# EAGLE design picotouch (EAGLE 9.6.2)
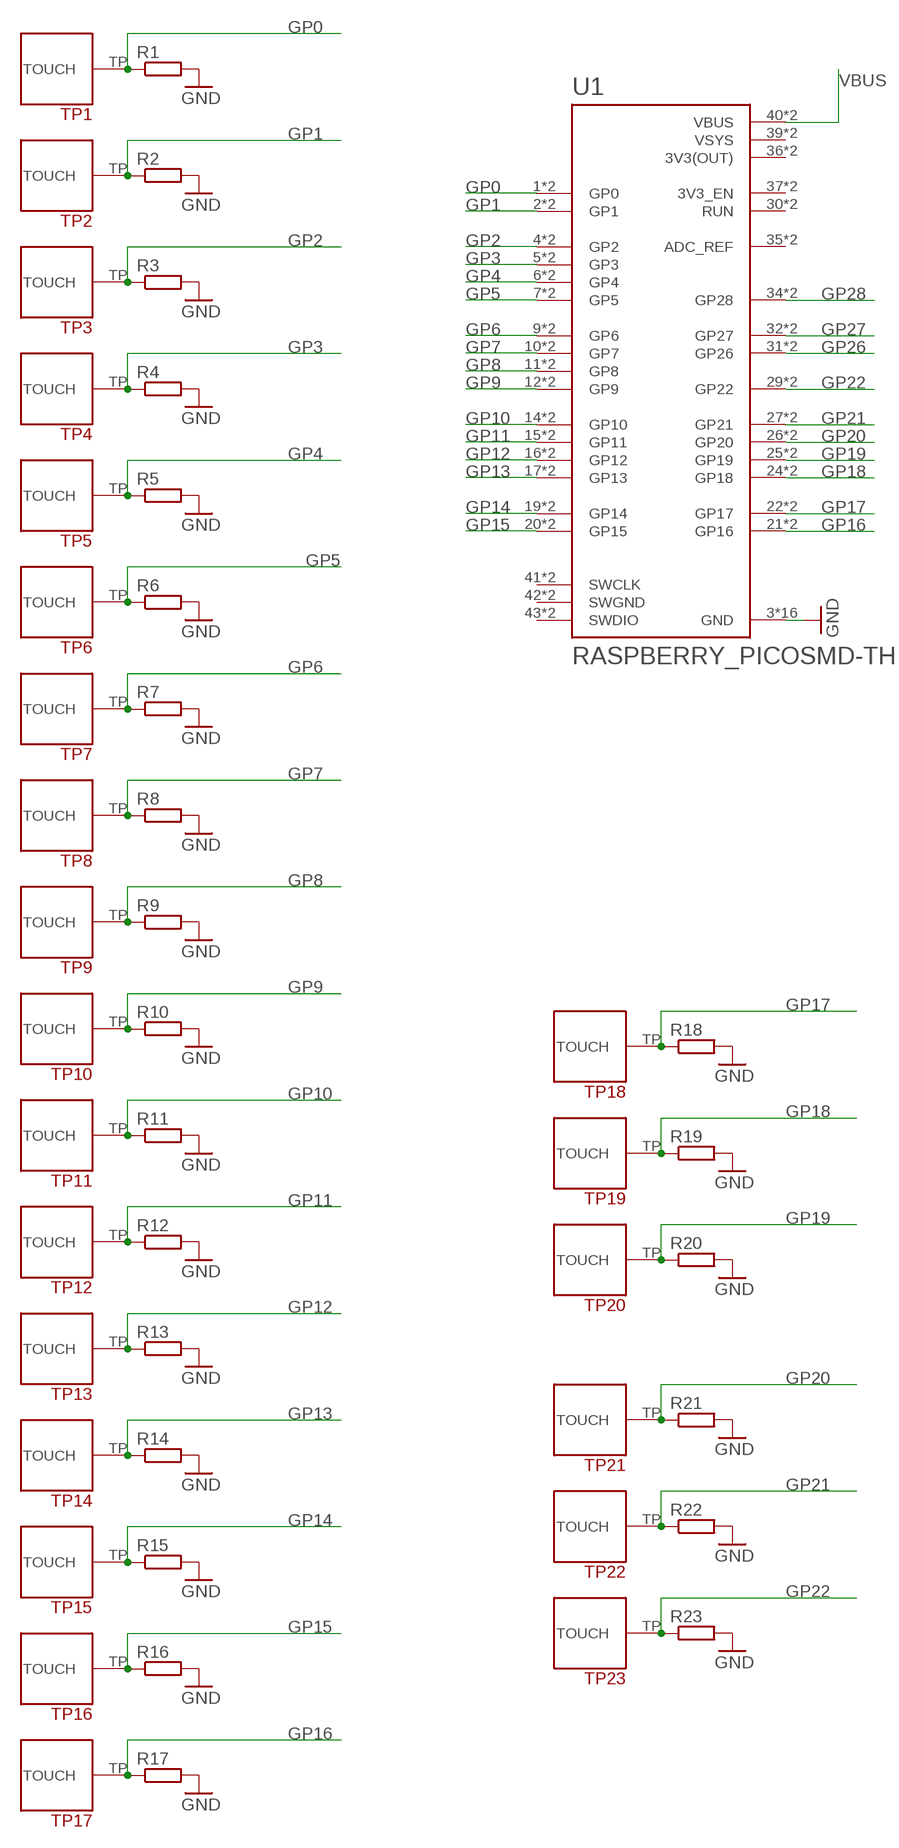
[diagram p0: schematic, sheet 1]

## Parts
R1  R-EU_R0805  [R0805]
R2  R-EU_R0805  [R0805]
R3  R-EU_R0805  [R0805]
R4  R-EU_R0805  [R0805]
R5  R-EU_R0805  [R0805]
R6  R-EU_R0805  [R0805]
R7  R-EU_R0805  [R0805]
R8  R-EU_R0805  [R0805]
R9  R-EU_R0805  [R0805]
R10  R-EU_R0805  [R0805]
R11  R-EU_R0805  [R0805]
R12  R-EU_R0805  [R0805]
R13  R-EU_R0805  [R0805]
R14  R-EU_R0805  [R0805]
R15  R-EU_R0805  [R0805]
R16  R-EU_R0805  [R0805]
R17  R-EU_R0805  [R0805]
R18  R-EU_R0805  [R0805]
R19  R-EU_R0805  [R0805]
R20  R-EU_R0805  [R0805]
R21  R-EU_R0805  [R0805]
R22  R-EU_R0805  [R0805]
R23  R-EU_R0805  [R0805]
TP1  TOUCHPADA  [TOUCHPADA]
TP2  TOUCHPADA  [TOUCHPADA]
TP3  TOUCHPADA  [TOUCHPADA]
TP4  TOUCHPADA  [TOUCHPADA]
TP5  TOUCHPADA  [TOUCHPADA]
TP6  TOUCHPADA  [TOUCHPADA]
TP7  TOUCHPADA  [TOUCHPADA]
TP8  TOUCHPADA  [TOUCHPADA]
TP9  TOUCHPADA  [TOUCHPADA]
TP10  TOUCHPADA  [TOUCHPADA]
TP11  TOUCHPADA  [TOUCHPADA]
TP12  TOUCHPADA  [TOUCHPADA]
TP13  TOUCHPADA  [TOUCHPADA]
TP14  TOUCHPADA  [TOUCHPADA]
TP15  TOUCHPADA  [TOUCHPADA]
TP16  TOUCHPADA  [TOUCHPADA]
TP17  TOUCHPADA  [TOUCHPADA]
TP18  TOUCHPADB  [TOUCHPADB]
TP19  TOUCHPADB  [TOUCHPADB]
TP20  TOUCHPADB  [TOUCHPADB]
TP21  TOUCHPADB  [TOUCHPADB]
TP22  TOUCHPADB  [TOUCHPADB]
TP23  TOUCHPADB  [TOUCHPADB]
U1  RASPBERRY_PICOSMD-TH  [PICO-PKG]

## Nets
GND: R1.2 R2.2 R3.2 R4.2 R5.2 R6.2 R7.2 R8.2 R9.2 R10.2 R11.2 R12.2 R13.2 R14.2 R15.2 R16.2 R17.2 R18.2 R19.2 R20.2 R21.2 R22.2 R23.2 U1.3(GND) U1.8(GND) U1.13(GND) U1.18(GND) U1.23(GND) U1.28(GND) U1.33(GND) U1.38(GND) U1.P$3(GND) U1.P$8(GND) U1.P$13(GND) U1.P$18(GND) U1.P$23(GND) U1.P$28(GND) U1.P$33(GND) U1.P$38(GND)
GP0: R1.1 TP1.TP(TOUCH) U1.1(GP0) U1.P$1(GP0)
GP1: R2.1 TP2.TP(TOUCH) U1.2(GP1) U1.P$2(GP1)
GP2: R3.1 TP3.TP(TOUCH) U1.4(GP2) U1.P$4(GP2)
GP3: R4.1 TP4.TP(TOUCH) U1.5(GP3) U1.P$5(GP3)
GP4: R5.1 TP5.TP(TOUCH) U1.6(GP4) U1.P$6(GP4)
GP5: R6.1 TP6.TP(TOUCH) U1.7(GP5) U1.P$7(GP5)
GP6: R7.1 TP7.TP(TOUCH) U1.9(GP6) U1.P$9(GP6)
GP7: R8.1 TP8.TP(TOUCH) U1.10(GP7) U1.P$10(GP7)
GP8: R9.1 TP9.TP(TOUCH) U1.11(GP8) U1.P$11(GP8)
GP9: R10.1 TP10.TP(TOUCH) U1.12(GP9) U1.P$12(GP9)
GP10: R11.1 TP11.TP(TOUCH) U1.14(GP10) U1.P$14(GP10)
GP11: R12.1 TP12.TP(TOUCH) U1.15(GP11) U1.P$15(GP11)
GP12: R13.1 TP13.TP(TOUCH) U1.16(GP12) U1.P$16(GP12)
GP13: R14.1 TP14.TP(TOUCH) U1.17(GP13) U1.P$17(GP13)
GP14: R15.1 TP15.TP(TOUCH) U1.19(GP14) U1.P$19(GP14)
GP15: R16.1 TP16.TP(TOUCH) U1.20(GP15) U1.P$20(GP15)
GP16: R17.1 TP17.TP(TOUCH) U1.21(GP16) U1.P$21(GP16)
GP17: R18.1 TP18.TP(TOUCH) U1.22(GP17) U1.P$22(GP17)
GP18: R19.1 TP19.TP(TOUCH) U1.24(GP18) U1.P$24(GP18)
GP19: R20.1 TP20.TP(TOUCH) U1.25(GP19) U1.P$25(GP19)
GP20: R21.1 TP21.TP(TOUCH) U1.26(GP20) U1.P$26(GP20)
GP21: R22.1 TP22.TP(TOUCH) U1.27(GP21) U1.P$27(GP21)
GP22: R23.1 TP23.TP(TOUCH) U1.29(GP22) U1.P$29(GP22)
GP26: U1.31(GP26) U1.P$31(GP26)
GP27: U1.32(GP27) U1.P$32(GP27)
GP28: U1.34(GP28) U1.P$34(GP28)
VBUS: U1.40(VBUS) U1.P$40(VBUS)
Unconnected: U1.30(RUN) U1.35(ADC_REF) U1.37(3V3_EN) U1.41(SWCLK) U1.43(SWDIO) U1.P$30(RUN) U1.P$35(ADC_REF) U1.P$37(3V3_EN) U1.P$41(SWCLK) U1.P$43(SWDIO)

## Power pins joined to a net without a drawn wire
3V3(OUT): U1.36(3V3(OUT)) U1.P$36(3V3(OUT))
SWGND: U1.42(SWGND) U1.P$42(SWGND)
VSYS: U1.39(VSYS) U1.P$39(VSYS)

## Library data of the parts
R1-R23 = rcl:R-EU_: RESISTOR, European symbol; SPICEPREFIX: R
TP1-TP23 = todstuff:TOUCHPAD
U1 = RpiPico:RASPBERRY_PICO: Raspberry Pi Pico

## Board
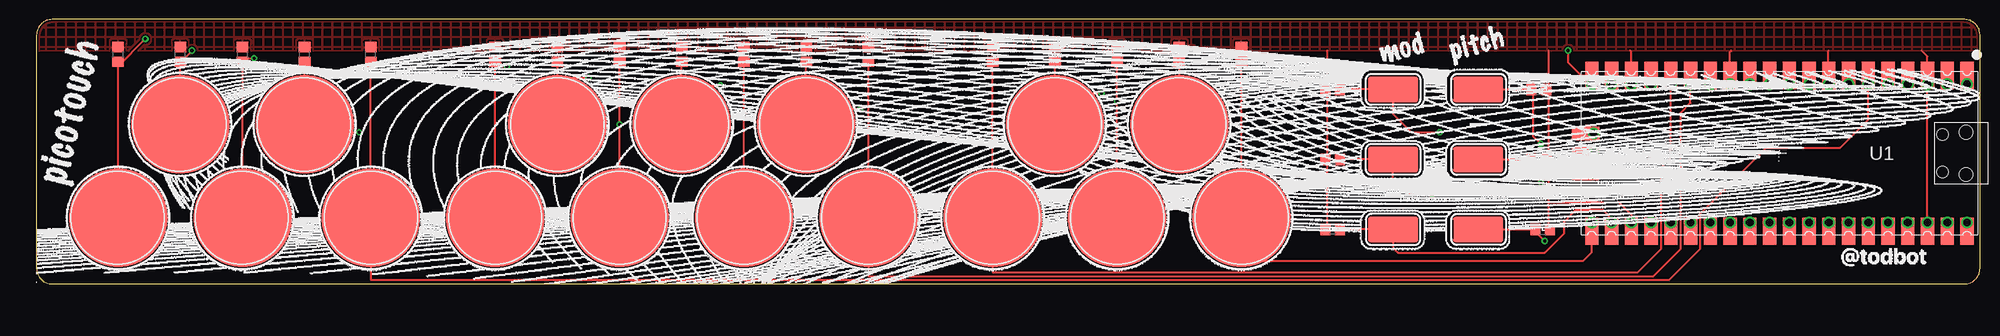
[diagram p1: board, top side]
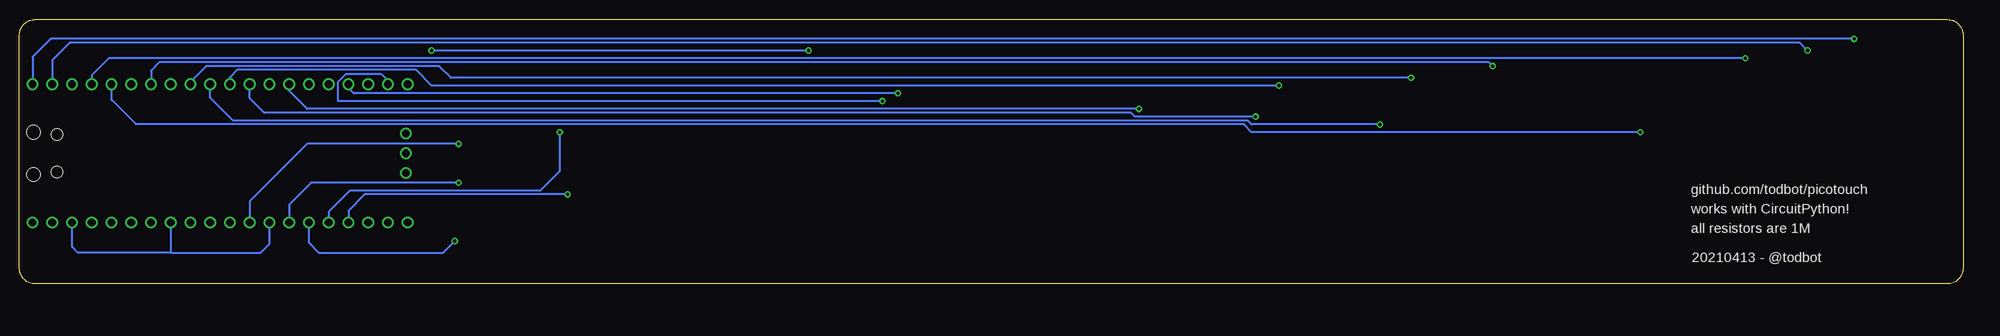
[diagram p2: board, bottom side, seen from below]

Size 250 x 34 mm. Coordinates in mm from the lower left corner, seen from the top.
Outline: 0,32 0,2 arc90 2,0 248,0 arc90 250,2 250,32 arc90 248,34 2,34 arc90 0,32
Copper layers (1*16): Top 0.035mm / dielectric 1.5mm / Bottom 0.035mm
Design rules "adafruit-rules-20180530 *": minimum track width 10mil, minimum drill 16mil, track to track 8mil, track to pad 8mil, pad to pad 8mil, via to via 8mil, smd to smd 8mil, copper to edge 10mil, drill to drill 8mil, minimum pad ring 10mil, minimum via ring 8mil, stop-mask expansion 4mil, vias tented up to drill 20mil, thermal gap 10mil

### Footprints (pad centres in the part's own frame; a part is rotated, then mirrored left to right if it is on the bottom)
R0805 = smd 1.3 x 1.5: 1 -0.95,0; 2 0.95,0
TOUCHPADA = smd 12.7 x 12.7: TP 0,0
TOUCHPADB = smd 6.452 x 3.251: TP 0,0
PICO-PKG = drill 1: 1 -8.89,24.13; 2 -8.89,21.59; 3 -8.89,19.05; 4 -8.89,16.51; 5 -8.89,13.97; 6 -8.89,11.43; 7 -8.89,8.89; 8 -8.89,6.35; 9 -8.89,3.81; 10 -8.89,1.27; 11 -8.89,-1.27; 12 -8.89,-3.81; 13 -8.89,-6.35; 14 -8.89,-8.89; 15 -8.89,-11.43; 16 -8.89,-13.97; 17 -8.89,-16.51; 18 -8.89,-19.05; 19 -8.89,-21.59; 20 -8.89,-24.13; 21 8.89,-24.13; 22 8.89,-21.59; 23 8.89,-19.05; 24 8.89,-16.51; 25 8.89,-13.97; 26 8.89,-11.43; 27 8.89,-8.89; 28 8.89,-6.35; 29 8.89,-3.81; 30 8.89,-1.27; 31 8.89,1.27; 32 8.89,3.81; 33 8.89,6.35; 34 8.89,8.89; 35 8.89,11.43; 36 8.89,13.97; 37 8.89,16.51; 38 8.89,19.05; 39 8.89,21.59; 40 8.89,24.13; 41 -2.54,-23.9; 42 0,-23.9; 43 2.54,-23.9 | smd 3.5 x 1.7: P$1 -10,24.13; P$2 -10,21.59; P$3 -10,19.05; P$4 -10,16.51; P$5 -10,13.97; P$6 -10,11.43; P$7 -10,8.89; P$8 -10,6.35; P$9 -10,3.81; P$10 -10,1.27; P$11 -10,-1.27; P$12 -10,-3.81; P$13 -10,-6.35; P$14 -10,-8.89; P$15 -10,-11.43; P$16 -10,-13.97; P$17 -10,-16.51; P$18 -10,-19.05; P$19 -10,-21.59; P$20 -10,-24.13; P$21 10,-24.13; P$22 10,-21.59; P$23 10,-19.05; P$24 10,-16.51; P$25 10,-13.97; P$26 10,-11.43; P$27 10,-8.89; P$28 10,-6.35; P$29 10,-3.81; P$30 10,-1.27; P$31 10,1.27; P$32 10,3.81; P$33 10,6.35; P$34 10,8.89; P$35 10,11.43; P$36 10,13.97; P$37 10,16.51; P$38 10,19.05; P$39 10,21.59; P$40 10,24.13 | smd 1.7 x 3.5: P$41 -2.54,-24.925; P$42 0,-24.925; P$43 2.54,-24.925 | hole 1.8: -2.725,24; 2.725,24 | hole 1.5: -2.425,20.97; 2.425,20.97

### Placement (x,y rotation side)
R1  10.5,29.5 90 top
R2  18.5,29.5 90 top
R3  26.5,29.5 90 top
R4  34.5,29.5 90 top
R5  43,29.5 90 top
R6  59,29.5 90 top
R7  67,29.5 90 top
R8  75,29.5 90 top
R9  83,29.5 90 top
R10  91,29.5 90 top
R11  99,29.5 90 top
R12  107,29.5 90 top
R13  123,29.5 90 top
R14  131,29.5 90 top
R15  139,29.5 90 top
R16  147,29.5 90 top
R17  155,29.5 90 top
R18  166.73,7 180 top
R19  166.73,16 180 top
R20  166.73,25 180 top
R21  193.73,7 0 top
R22  193.23,16 0 top
R23  193.23,25 0 top
TP1  10.5,8.5 0 top
TP2  18.5,20.5 0 top
TP3  26.5,8.5 0 top
TP4  34.5,20.5 0 top
TP5  43,8.5 0 top
TP6  59,8.5 0 top
TP7  67,20.5 0 top
TP8  75,8.5 90 top
TP9  83,20.5 0 top
TP10  91,8.5 0 top
TP11  99,20.5 0 top
TP12  107,8.5 0 top
TP13  123,8.5 0 top
TP14  131,20.5 0 top
TP15  139,8.5 0 top
TP16  147,20.5 0 top
TP17  155,8.5 0 top
TP18  174.5,7 0 top
TP19  174.5,16 0 top
TP20  174.5,25 0 top
TP21  185.46,7 0 top
TP22  185.46,16 0 top
TP23  185.46,25 0 top
U1  224.19,16.78 270 top
U$1  [PICOTOUCH_TOPSILK]  0,0 0 top

### Tracks (layer width: path | path; a pad name or v marks a point on that pad's centre or on a via)
3V3(OUT)
  Top 0.254: U1.P$36 U1.36
GND
  Top 0.254: 194.5,25 194.5,16 | 194.5,16 194.5,10.5 | 194.5,10.5 194.5,7 R21.2 | 194.5,16 R22.2 | 166,16 166,7 R18.2 | 166,30 166,25 | 166,25 166,16 | 166,16 R19.2 | 166,25 R20.2 | 194.5,30 194.5,25 | 194.5,25 R23.2 | 194.5,10.5 203.53,10.5 205.14,8.89 U1.23 U1.P$23 | U1.P$28 U1.28 | U1.P$33 U1.33 | U1.38 U1.P$38 U1.3 U1.P$3 243.24,29.26 242.5,30 | U1.8 U1.P$8 230.5,26.82 230.5,30 | 218,30 217.84,29.84 U1.P$13 U1.13 | U1.18 U1.P$18 205.14,29.86 205,30
  Bottom 0.254: U1.28 217.84,5.16 219,4 230.5,4 | 230.5,4 230.5,7.85 U1.33 | U1.38 243.24,4.74 242.5,4 230.5,4
  pour Top (hatched): -1,35 252.5,35 252.5,30 -1,30
GP0  (via drill 0.41)
  Top 0.254: TP1.TP 10.5,28 | 10.5,28 v14,31.5 | 10.5,28 R1.1 | U1.P$1 U1.1
  Bottom 0.254: v14,31.5 246,31.5 248.32,29.18 U1.1
GP1  (via drill 0.41)
  Top 0.254: TP2.TP 18.5,28.5 | 18.5,28.5 v20,30 | 18.5,28.5 R2.1 | U1.P$2 U1.2
  Bottom 0.254: v20,30 21,31 243.5,31 245.78,28.72 U1.2
GP2  (via drill 0.41)
  Top 0.254: TP3.TP R3.1 26.5,29 v28,29 | U1.P$4 U1.4
  Bottom 0.254: U1.4 240.7,26.8 238.5,29 v28,29
GP3  (via drill 0.41)
  Top 0.254: R4.1 TP4.TP 34.5,19.5 v41.5,19.5 | U1.P$5 U1.5
  Bottom 0.254: v41.5,19.5 91.5,19.5 92.5,20.5 235,20.5 238.16,23.66 U1.5
GP4
  Top 0.254: R5.1 TP5.TP 43,0.5 210,0.5 214,4.5 214,9 222.5,17.5 232,17.5 235.62,21.12 U1.6 235.62,26 U1.P$6
GP5  (via drill 0.41)
  Top 0.254: TP6.TP 59,28 | 59,28 v60.5,28 | 59,28 R6.1 | U1.P$7 U1.7
  Bottom 0.254: v60.5,28 61,28.5 232,28.5 233.08,27.42 U1.7
GP6  (via drill 0.41)
  Top 0.254: 67,26.5 R7.1 | U1.P$9 U1.9 | 67,26.5 v71,26.5 | 67,26.5 TP7.TP
  Bottom 0.254: v71,26.5 194.5,26.5 196,28 226,28 228,26 U1.9
GP7  (via drill 0.41)
  Top 0.254: TP8.TP v75,20.5 R8.1 | U1.P$10 U1.10
  Bottom 0.254: v75,20.5 91.5,20.5 92,21 222.5,21 225.46,23.96 U1.10
GP8  (via drill 0.41)
  Top 0.254: 83,25.5 R9.1 | 83,25.5 v88,25.5 | 83,25.5 TP9.TP | U1.P$11 U1.11
  Bottom 0.254: v88,25.5 197,25.5 199,27.5 222,27.5 222.92,26.58 U1.11
GP9  (via drill 0.41)
  Top 0.254: TP10.TP v91,21.5 R10.1 | U1.P$12 U1.12
  Bottom 0.254: v91,21.5 106.5,21.5 107,22 218.5,22 220.38,23.88 U1.12
GP10  (via drill 0.41)
  Top 0.254: 99,22.5 R11.1 | 99,22.5 v106,22.5 | 99,22.5 TP11.TP | U1.P$14 U1.14
  Bottom 0.254: v106,22.5 213,22.5 215.3,24.8 U1.14
GP11
  Top 0.254: R12.1 TP12.TP 107,1 208,1 211.5,4.5 211.5,22 212.76,23.26 U1.15 212.76,26.5 U1.P$15
GP12
  Top 0.254: R13.1 TP13.TP 123,1.5 206,1.5 209,4.5 209,15 210.22,16.22 U1.16 210.22,26.5 U1.P$16
GP13  (via drill 0.41)
  Top 0.254: 131,24.5 R14.1 | 131,24.5 v137,24.5 | 131,24.5 TP14.TP | U1.P$17 U1.17
  Bottom 0.254: U1.17 207.68,25.18 207,24.5 v137,24.5
GP14  (via drill 0.41)
  Top 0.254: TP15.TP v139,23.5 R15.1 | U1.P$19 U1.19
  Bottom 0.254: v139,23.5 209,23.5 209,26 208,27 203.5,27 202.6,26.1 U1.19
GP15  (via drill 0.41)
  Top 0.254: TP16.TP 147,28.5 | 147,28.5 v148.5,30 | 147,28.5 R16.1 | U1.20 U1.P$20 198.72,26.78 197,28.5 v197,30
  Bottom 0.254: v148.5,30 v197,30
GP16
  Top 0.254: R17.1 TP17.TP 155,3 199,3 200.06,4.06 U1.P$21 U1.21
GP17
  Top 0.254: R18.1 TP18.TP 174.5,4.62 175.12,4 194,4 196.5,6.5 196.5,8 198,9.5 201.5,9.5 202.6,8.4 U1.22 U1.P$22
GP18  (via drill 0.41)
  Top 0.254: R19.1 TP19.TP 174.5,13.25 176.25,11.5 v179.5,11.5 | U1.P$24 U1.24
  Bottom 0.254: U1.24 207.68,9.39 205.57,11.5 v179.5,11.5
GP19  (via drill 0.41)
  Top 0.254: R20.1 TP20.TP 174.5,21.88 176.88,19.5 v180.5,19.5 | U1.P$25 U1.25
  Bottom 0.254: v180.5,19.5 180.5,14.5 183,12 207.5,12 210.22,9.28 U1.25
GP20  (via drill 0.41)
  Top 0.254: TP21.TP R21.1 193,7 193,6.5 v194,5.5 | U1.P$26 U1.26
  Bottom 0.254: U1.26 212.76,5.26 211.5,4 195.5,4 v194,5.5
GP21  (via drill 0.41)
  Top 0.254: TP22.TP R22.1 192.5,16 192.5,14 v193.5,13 | U1.P$27 U1.27
  Bottom 0.254: U1.27 215.3,10.2 212.5,13 v193.5,13
GP22  (via drill 0.41)
  Top 0.254: TP23.TP R23.1 192.5,25 192.5,19 v193.5,18 | U1.P$29 U1.29
  Bottom 0.254: U1.29 220.38,10.62 213,18 v193.5,18
GP26
  Top 0.254: U1.P$31 U1.31
GP27
  Top 0.254: U1.P$32 U1.32
GP28
  Top 0.254: U1.P$34 U1.34
SWGND
  Top 0.254: U1.P$42 U1.42
VBUS
  Top 0.254: U1.P$40 U1.40
VSYS
  Top 0.254: U1.P$39 U1.39

### Text on the board
bPlace: github.com/todbot/picotouch | works with CircuitPython! | all resistors are 1M | 20210413 - @todbot